# Altium schematic sheet Sheet_1_2022-08-28.schdoc
size 179 x 127 mm
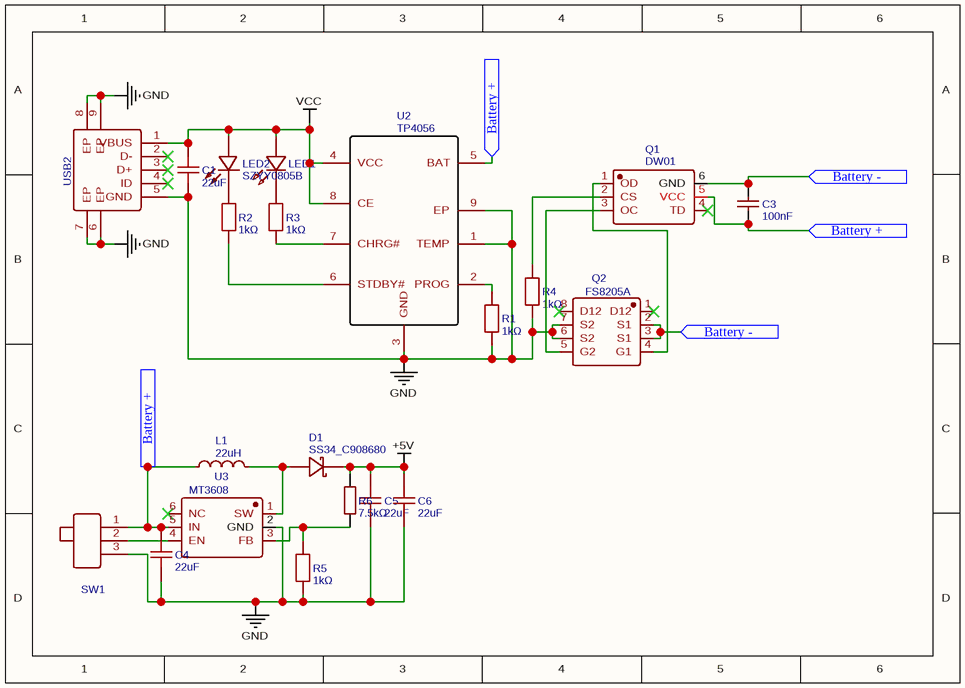
[diagram p0: Sheet_1_2022-08-28.schdoc]

## Parts
C1  22uF  [C0805]
C3  100nF  [C0805]
C4  22uF  [C0805]
C5  22uF  [C0805]
C6  22uF  [C0805]
D1  SS34_C908680  [SMA_L4.3-W2.7-LS5.1-RD]
L1  22uH  [IND-SMD_L8.0-W8.0_ABG08A40]
LED1  TZ-P2-0805RTCS2-0.8T  [LED0805-RD_RED]  (value not drawn)
LED2  SZYY0805B  [LED0805-R-RD_BLUE]
Q1  DW01  [SOT-23-6_L2.9-W1.6-P0.95-LS2.8-BR]
Q2  FS8205A  [TSSOP-8_L4.4-W3.0-P0.65-LS6.4-BL-2]
R1  1kΩ  [R0805]
R2  1kΩ  [R0805]
R3  1kΩ  [R0805]
R4  1kΩ  [R0805]
R5  1kΩ  [R0805]
R6  7.5kΩ  [R0805]
SW1  MK-12D18-G020  [SW-TH_MK-12D18-G040]  (value not drawn)
U2  TP4056  [ESOP-8_L4.9-W3.9-P1.27-LS6.0-BL-EP]
U3  MT3608  [SOT-23-6_L2.9-W1.6-P0.95-LS2.8-BR]
USB2  U-F-M5DS-Y-2  [MICRO-USB-SMD_MICRO-USB-A20-TH]  (value not drawn)

## Ports
Battery + (in), Battery - (in)

## Nets
+5V: C5.1 C6.1 D1.1(C) R6.2
GND: C1.2 C4.2 C5.2 C6.2 Q2.6(S2) Q2.7(S2) R1.1 R4.1 R5.1 SW1.3 U2.1(TEMP) U2.3(GND) U2.9(EP) U3.2(GND) USB2.5(GND) USB2.6(EP) USB2.7(EP) USB2.8(EP) USB2.9(EP)
VCC: C1.1 LED1.2(A) LED2.1(+) U2.4(VCC) U2.8(CE) USB2.1(VBUS)
Battery +: C3.2 C4.1 L1.1 Q1.5(VCC) SW1.1 U2.5(BAT) U3.5(IN) ; port Battery +
Battery -: C3.1 Q1.6(GND) Q2.2(S1) Q2.3(S1) ; port Battery -
NetD1_2: D1.2(A) L1.2 U3.1(SW)
NetLED1_1: LED1.1(K) R3.2
NetLED2_2: LED2.2(-) R2.2
NetQ1_1: Q1.1(OD) Q2.4(G1)
NetQ1_2: Q1.2(CS) R4.2
NetQ1_3: Q1.3(OC) Q2.5(G2)
NetR1_2: R1.2 U2.2(PROG)
NetR2_1: R2.1 U2.6(STDBY#)
NetR3_1: R3.1 U2.7(CHRG#)
NetR5_2: R5.2 R6.1 U3.3(FB)
NetSW1_2: SW1.2 U3.4(EN)

Not connected (* = marked no-connect by the designer): Q1 4(TD)*; Q2 1(D12)* 8(D12)*; U3 6(NC)*; USB2 2(D-)* 3(D+)* 4(ID)*

## Library data of the parts
C1 C4-C6 = 22uF: BOM_Manufacturer: FH; BOM_Manufacturer Part: 0805F226M250NT; nameAlias: Capacitance; Contributor: LCSC; BOM_Supplier: LCSC; BOM_Supplier Part: C161205; BOM_JLCPCB Part Class: Extended Part; spicePre: C; spiceSymbolName: 0805F226M250NT
C3 = 100nF: BOM_Manufacturer: FH; BOM_Manufacturer Part: 0805B104J500NT; nameAlias: Capacitance; BOM_Supplier: LCSC; BOM_Supplier Part: C29926; BOM_JLCPCB Part Class: Extended Part; spicePre: C; spiceSymbolName: 0805B104J500NT
D1 = SS34_C908680: BOM_Manufacturer: GOODWORK(固得沃克); BOM_Manufacturer Part: SS34; Contributor: LCSC; BOM_Supplier: LCSC; BOM_Supplier Part: C908680; BOM_JLCPCB Part Class: Extended Part; spicePre: D; spiceSymbolName: SS34_C908680
L1 = 22uH: BOM_Manufacturer: CENKER; BOM_Manufacturer Part: CKCS8040-22uH/M; nameAlias: Inductance; Contributor: LCSC; BOM_Supplier: LCSC; BOM_Supplier Part: C354640; BOM_JLCPCB Part Class: Extended Part; spicePre: L; spiceSymbolName: CKCS8040-22UH/M
LED1 = TZ-P2-0805RTCS2-0.8T: BOM_Manufacturer: TUOZHAN; Contributor: LCSC; BOM_Supplier: LCSC; BOM_Supplier Part: C688884; BOM_Manufacturer Part: TZ-P2-0805RTCS2-0.8T; BOM_JLCPCB Part Class: Extended Part; spicePre: L; spiceSymbolName: TZ-P2-0805RTCS2-0.8T
LED2 = SZYY0805B: BOM_Manufacturer: Yongyu Photoelectric; Contributor: LCSC; BOM_Supplier: LCSC; BOM_Supplier Part: C434433; BOM_Manufacturer Part: SZYY0805B; BOM_JLCPCB Part Class: Extended Part; spicePre: L; spiceSymbolName: SZYY0805B
Q1 = DW01: BOM_Manufacturer: Hottech; Contributor: LCSC; BOM_Supplier: LCSC; BOM_Manufacturer Part: DW01; BOM_Supplier Part: C181096; BOM_JLCPCB Part Class: Extended Part; spicePre: Q; spiceSymbolName: DW01
Q2 = FS8205A: BOM_Manufacturer: FORTUNE; BOM_Supplier: LCSC; BOM_Manufacturer Part: FS8205A; BOM_Supplier Part: C16052; BOM_JLCPCB Part Class: Extended Part; spicePre: Q; spiceSymbolName: FS8205A
R1-R5 = 1kΩ: BOM_Manufacturer: ResistorToday; BOM_Manufacturer Part: PTFR0805D1K00P9; Resistance (Ohms): 1K; nameAlias: Resistance; Contributor: LCSC; BOM_Supplier: LCSC; BOM_Supplier Part: C374884; BOM_JLCPCB Part Class: Extended Part; spicePre: R; spiceSymbolName: PTFR0805D1K00P9
R6 = 7.5kΩ: BOM_Manufacturer: UniOhm; BOM_Manufacturer Part: 0805W8J0752T5E; nameAlias: Resistance; Resistance (Ohms): 7.5K; BOM_Supplier: LCSC; BOM_Supplier Part: C26027; BOM_JLCPCB Part Class: Extended Part; spicePre: R; spiceSymbolName: 0805W8J0752T5E
SW1 = MK-12D18-G020: BOM_Manufacturer: G-Switch(品赞); Contributor: lcsc; BOM_Supplier: LCSC; BOM_Supplier Part: C3019727; BOM_Manufacturer Part: MK-12D18-G020; link: https://atta.szlcsc.com/upload/public/pdf/source/20201201/C963202_825FB742C5BA766BED52E1DDA96DE5A3.pdf; BOM_JLCPCB Part Class: Extended Part; spicePre: S; spiceSymbolName: MK-12D18-G020
U2 = TP4056: BOM_Manufacturer: TOPPOWER; Contributor: Guest; BOM_Supplier: LCSC; BOM_Manufacturer Part: TP4056; BOM_Supplier Part: C16581; BOM_JLCPCB Part Class: Basic Part; spicePre: U; spiceSymbolName: TP4056
U3 = MT3608: BOM_Manufacturer: AEROSEMI; BOM_Supplier: LCSC; BOM_Manufacturer Part: MT3608; BOM_Supplier Part: C84817; BOM_JLCPCB Part Class: Extended Part; spicePre: U; spiceSymbolName: MT3608
USB2 = U-F-M5DS-Y-2: BOM_Manufacturer: HRO; Contributor: LCSC; BOM_Supplier: LCSC; BOM_Manufacturer Part: U-F-M5DS-Y-2; BOM_Supplier Part: C94901; BOM_JLCPCB Part Class: Extended Part; spicePre: U; spiceSymbolName: U-F-M5DS-Y-2